# Altium project CARRIER BOARD.PrjPcb
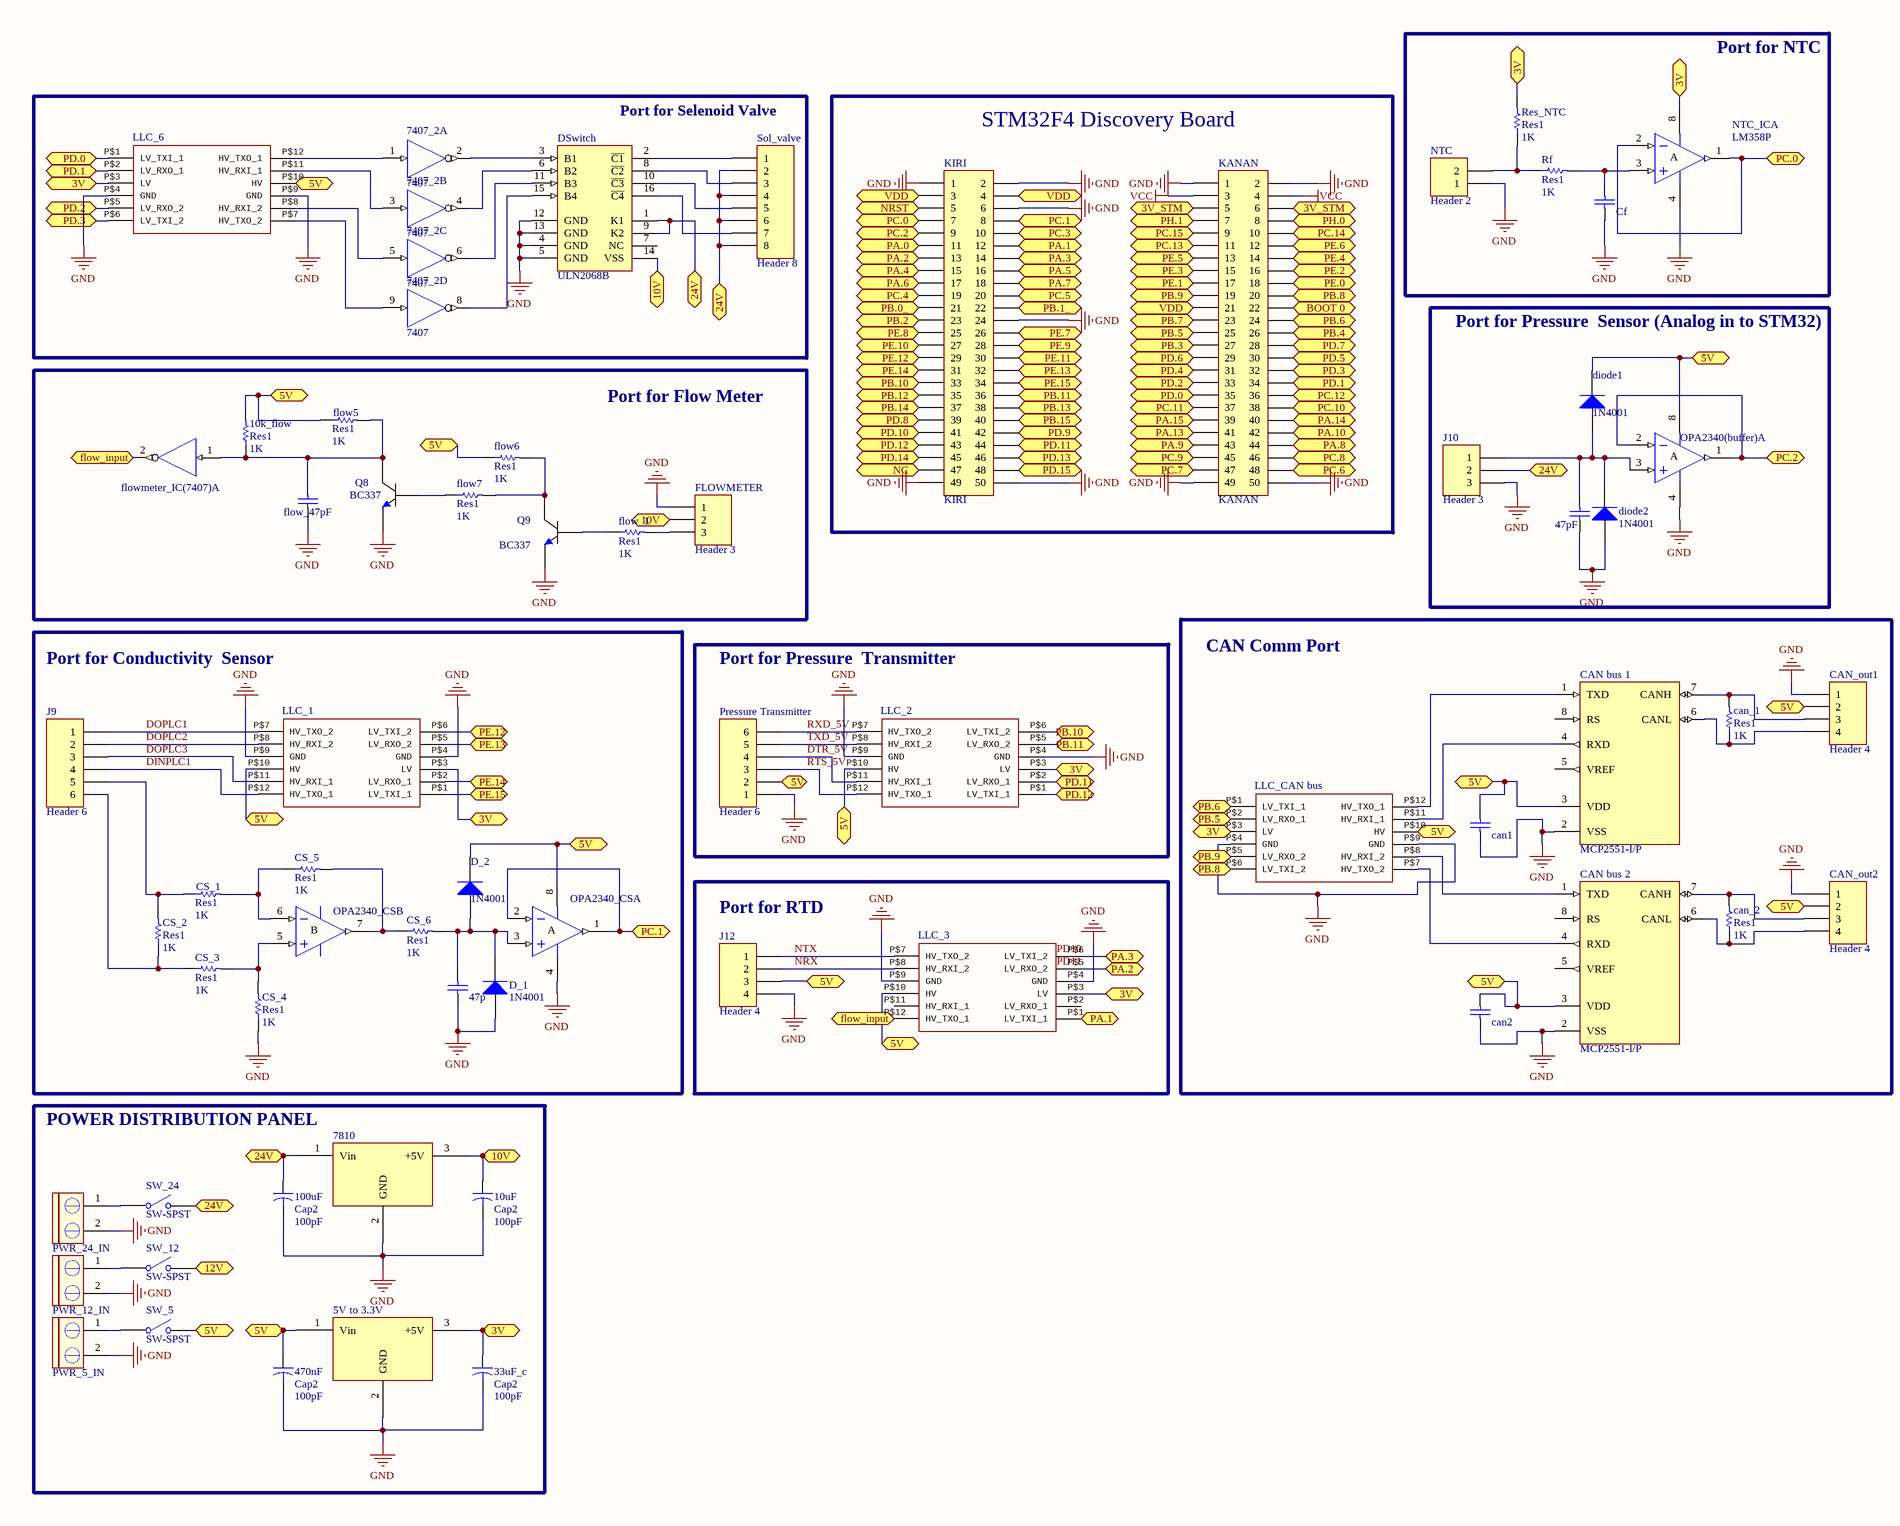
[diagram p0: Page2_.SchDoc, left]
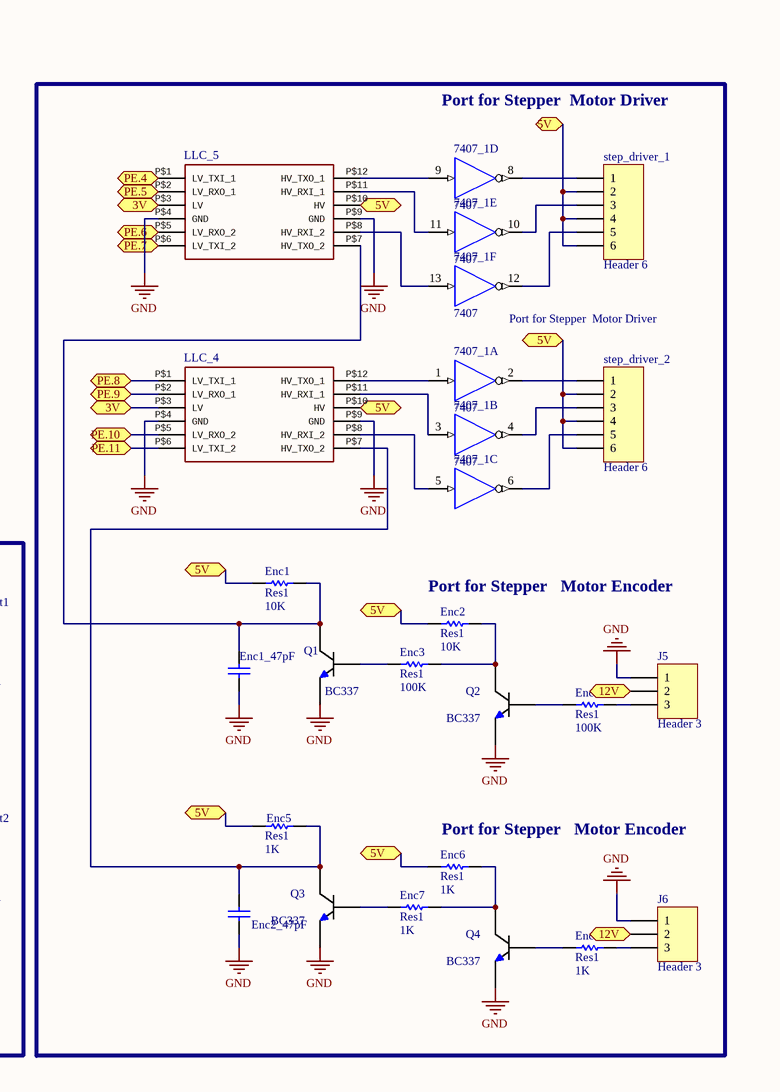
[diagram p1: Page2_.SchDoc, right]
3 sheets, 98 parts. Net scope: hierarchical (ports join the sheet entries above them; power ports are global).
Board file: carrier board mixing.PcbDoc
Sheets:
  Page2_.SchDoc
  Page3_POWER.SchDoc
    conductivity sensor = conductivity.SchDoc

## Sheet Page2_.SchDoc
size A2

### Parts
(Parts that share a designator on the sheet are numbered #1, #2 ... from top to bottom, then left to right.)
5V_to_3.3V  7805  [My_TO-220]  (value not drawn)
10k_flow  Res1  value 1K  [AXIAL-0.3]
10uF  Cap2  value 100pF  [CAPR5-4X5]
33uF_c  Cap2  value 100pF  [CAPR5-4X5]
47p#1  Cap  [My_cap100n]  (value not drawn)
47pF  Cap  [My_cap100n]  (value not drawn)
100uF  Cap2  value 100pF  [CAPR5-4X5]
470nF  Cap2  value 100pF  [CAPR5-4X5]
7407_1  7407  [646-06]  (parts A,B,C,D,E,F of 6)
7407_2  7407  [646-06]  (parts A,B,C,D of 6)
7810  7805  [My_TO-220]  (value not drawn)
can1  Cap  [My_cap100n]  (value not drawn)
can2  Cap  [My_cap100n]  (value not drawn)
can_1  Res1  value 1K  [AXIAL-0.3]
can_2  Res1  value 1K  [AXIAL-0.3]
CAN_bus_1  MCP2551-I/P  [PDIP300-P8]
CAN_bus_2  MCP2551-I/P  [PDIP300-P8]
CAN_out1  Header 4  [HDR1X4]
CAN_out2  Header 4  [HDR1X4]
Cf  Cap  [My_cap100n]  (value not drawn)
CS_1#1  Res1  value 1K  [AXIAL-0.3]
CS_2#1  Res1  value 1K  [AXIAL-0.3]
CS_3#1  Res1  value 1K  [AXIAL-0.3]
CS_4#1  Res1  value 1K  [AXIAL-0.3]
CS_5#1  Res1  value 1K  [AXIAL-0.3]
CS_6#1  Res1  value 1K  [AXIAL-0.3]
D_1#1  1N4001  [DO-41]
D_2#1  1N4001  [DO-41]
diode1  1N4001  [DO-41]
diode2  1N4001  [DO-41]
DSwitch  ULN2068B  [648C-02]
Enc1  Res1  value 10K  [AXIAL-0.3]
Enc1_47pF  Cap  [My_cap100n]  (value not drawn)
Enc2  Res1  value 10K  [AXIAL-0.3]
Enc2_47pF  Cap  [My_cap100n]  (value not drawn)
Enc3  Res1  value 100K  [AXIAL-0.3]
Enc4  Res1  value 100K  [AXIAL-0.3]
Enc5  Res1  value 1K  [AXIAL-0.3]
Enc6  Res1  value 1K  [AXIAL-0.3]
Enc7  Res1  value 1K  [AXIAL-0.3]
Enc8  Res1  value 1K  [AXIAL-0.3]
flow5  Res1  value 1K  [AXIAL-0.3]
flow6  Res1  value 1K  [AXIAL-0.3]
flow7  Res1  value 1K  [AXIAL-0.3]
flow_1  Res1  value 1K  [AXIAL-0.3]
flow_47pF  Cap  [My_cap100n]  (value not drawn)
FLOWMETER  Header 3  [HDR1X3]
flowmeter_IC(7407)  SN74LS14N  [646-06]  (value not drawn)  (part A of 6)
J5  Header 3  [HDR1X3]
J6  Header 3  [HDR1X3]
J9#1  Header 6  [HDR1X6]
J10  Header 3  [HDR1X3]
J12  Header 4  [HDR1X4]
KANAN#1  KANAN  [HDR2X25]
KIRI#1  KIRI  [HDR2X25]
LLC_1#1  Logic Level Converter (3.3v - 5v) / https://www.sparkfun.com/products/8745  [LOGIC_LEVEL_CONVERTER]  (value not drawn)
LLC_2  Logic Level Converter (3.3v - 5v) / https://www.sparkfun.com/products/8745  [LOGIC_LEVEL_CONVERTER]  (value not drawn)
LLC_3  Logic Level Converter (3.3v - 5v) / https://www.sparkfun.com/products/8745  [LOGIC_LEVEL_CONVERTER]  (value not drawn)
LLC_4  Logic Level Converter (3.3v - 5v) / https://www.sparkfun.com/products/8745  [LOGIC_LEVEL_CONVERTER]  (value not drawn)
LLC_5  Logic Level Converter (3.3v - 5v) / https://www.sparkfun.com/products/8745  [LOGIC_LEVEL_CONVERTER]  (value not drawn)
LLC_6  Logic Level Converter (3.3v - 5v) / https://www.sparkfun.com/products/8745  [LOGIC_LEVEL_CONVERTER]  (value not drawn)
LLC_CAN_bus  Logic Level Converter (3.3v - 5v) / https://www.sparkfun.com/products/8745  [LOGIC_LEVEL_CONVERTER]  (value not drawn)
NTC  Header 2  [HDR1X2]
NTC_IC  LM358P  [P008]  (part A of 2)
OPA2340(buffer)  LM358P  [P008]  (value not drawn)  (part A of 2)
OPA2340_CS#1  LM358P  [P008]  (value not drawn)  (parts A,B of 2)
Pressure_Transmitter  Header 6  [HDR1X6]
PWR_5_IN  CON2 pin blue  [My_CN2]  (value not drawn)
PWR_12_IN  CON2 pin blue  [My_CN2]  (value not drawn)
PWR_24_IN  CON2 pin blue  [My_CN2]  (value not drawn)
Q1  BC337  [TO-92]
Q2  BC337  [TO-92]
Q3  BC337  [TO-92]
Q4  BC337  [TO-92]
Q8  BC337  [TO-92]
Q9  BC337  [TO-92]
Res_NTC  Res1  value 1K  [AXIAL-0.3]
Rf  Res1  value 1K  [AXIAL-0.3]
Sol_valve  Header 8  [HDR1X8]
step_driver_1  Header 6  [HDR1X6]
step_driver_2  Header 6  [HDR1X6]
SW_5  SW-SPST  [SPST-2]
SW_12  SW-SPST  [SPST-2]
SW_24  SW-SPST  [SPST-2]

### Blocks framed on the sheet
Port for NTC: Cf NTC NTC_IC Res_NTC Rf
Port for Selenoid Valve: 7407_2 DSwitch LLC_6 Sol_valve
STM32F4 Discovery Board: KANAN#1 KIRI#1
Port for Pressure  Sensor (Analog in to STM32): 47pF diode1 diode2 J10 OPA2340(buffer)
Port for Flow Meter: 10k_flow flow5-flow7 flow_1 flow_47pF FLOWMETER flowmeter_IC(7407) Q8 Q9
Port for Conductivity  Sensor: 47p#1 CS_1#1 CS_2#1 CS_3#1 CS_4#1 CS_5#1 CS_6#1 D_1#1 D_2#1 J9#1 LLC_1#1 OPA2340_CS#1
CAN Comm Port: can1 can2 can_1 can_2 CAN_bus_1 CAN_bus_2 CAN_out1 CAN_out2 LLC_CAN_bus
Port for Pressure  Transmitter: LLC_2 Pressure_Transmitter
Port for RTD: J12 LLC_3
POWER DISTRIBUTION PANEL: 5V_to_3.3V 10uF 33uF_c 100uF 470nF 7810 PWR_5_IN PWR_12_IN PWR_24_IN SW_5 SW_12 SW_24

### Ports
3V, 3V_STM, 5V, 10V, 12V, 24V, BOOT 0, flow_input, NC, NRST, PA.0, PA.1, PA.2, PA.3, PA.4, PA.5, PA.6, PA.7, PA.8, PA.9, PA.10, PA.13, PA.14, PA.15, PB.0_, PB.1_, PB.2, PB.3, PB.4, PB.5, PB.6, PB.7, PB.8, PB.9, PB.10, PB.11, PB.12, PB.13, PB.14, PB.15, PC.0, PC.1, PC.2, PC.3, PC.4, PC.5, PC.6, PC.7, PC.8, PC.9, PC.10, PC.11, PC.12, PC.13, PC.14, PC.15, PD.0, PD.1, PD.2, PD.3, PD.4, PD.5, PD.6, PD.7, PD.8, PD.9, PD.10, PD.11, PD.12, PD.13, PD.14, PD.15, PE.0, PE.1, PE.2, PE.3, PE.4, PE.5, PE.6, PE.7, PE.8, PE.9, PE.10, PE.11, PE.12, PE.13, PE.14, PE.15, PH.0, PH.1, VDD

### Nets
GND: 5V_to_3.3V.2(GND) 10uF.2 33uF_c.2 47p#1.1 47pF.1 100uF.2 470nF.2 7407_1.7(GND) 7407_2.7(GND) 7810.2(GND) can1.1 can2.1 CAN_bus_1.2(VSS) CAN_bus_2.2(VSS) CAN_out1.1 CAN_out2.1 Cf.1 CS_4#1.1 D_1#1.1(A) diode2.1(A) DSwitch.4(GND) DSwitch.5(GND) DSwitch.12(GND) DSwitch.13(GND) Enc1_47pF.1 Enc2_47pF.1 flow_47pF.1 FLOWMETER.1 flowmeter_IC(7407).7(GND) J5.1 J6.1 J10.3 J12.4 KANAN#1.1 KANAN#1.2 KANAN#1.49 KANAN#1.50 KIRI#1.1 KIRI#1.2 KIRI#1.6 KIRI#1.24 KIRI#1.49 KIRI#1.50 LLC_1#1.P$4(GND) LLC_1#1.P$9(GND) LLC_2.P$4(GND) LLC_2.P$9(GND) LLC_3.P$4(GND) LLC_3.P$9(GND) LLC_4.P$4(GND) LLC_4.P$9(GND) LLC_5.P$4(GND) LLC_5.P$9(GND) LLC_6.P$4(GND) LLC_6.P$9(GND) LLC_CAN_bus.P$4(GND) LLC_CAN_bus.P$9(GND) NTC.1 NTC_IC.4(V-) OPA2340(buffer).4(V-) OPA2340_CS#1.4(V-) Pressure_Transmitter.1 PWR_5_IN.2 PWR_12_IN.2 PWR_24_IN.2 Q1.3(E) Q2.3(E) Q3.3(E) Q4.3(E) Q8.3(E) Q9.3(E)
VCC: KANAN#1.3 KANAN#1.4
VDD: 7407_1.14(VDD) 7407_2.14(VDD) flowmeter_IC(7407).14(VDD)
DINPLC1: J9#1.4 LLC_1#1.P$12(HV_TXO_1)
DOPLC1: J9#1.1 LLC_1#1.P$7(HV_TXO_2)
DOPLC2: J9#1.2 LLC_1#1.P$8(HV_RXI_2)
DOPLC3: J9#1.3 LLC_1#1.P$11(HV_RXI_1)
DTR_5V: LLC_2.P$11(HV_RXI_1) Pressure_Transmitter.4
NRX: J12.2 LLC_3.P$8(HV_RXI_2)
NTX: J12.1 LLC_3.P$7(HV_TXO_2)
RTS_5V: LLC_2.P$12(HV_TXO_1) Pressure_Transmitter.3
RXD_5V: LLC_2.P$7(HV_TXO_2) Pressure_Transmitter.6
TXD_5V: LLC_2.P$8(HV_RXI_2) Pressure_Transmitter.5
Net5V_to_3.3V_1: 5V_to_3.3V.1(Vin) 10k_flow.2 470nF.1 can1.2 can2.2 CAN_bus_1.3(VDD) CAN_bus_2.3(VDD) CAN_out1.2 CAN_out2.2 D_2#1.2(K) diode1.2(K) Enc1.1 Enc2.1 Enc5.1 Enc6.1 flow5.1 flow6.1 J12.3 LLC_1#1.P$10(HV) LLC_2.P$10(HV) LLC_3.P$10(HV) LLC_4.P$10(HV) LLC_5.P$10(HV) LLC_6.P$10(HV) LLC_CAN_bus.P$10(HV) OPA2340(buffer).8(V+) OPA2340_CS#1.8(V+) Pressure_Transmitter.2 step_driver_1.2 step_driver_1.4 step_driver_1.6 step_driver_2.2 step_driver_2.4 step_driver_2.6 SW_5.2(NO) ; port 5V
Net5V_to_3.3V_3: 5V_to_3.3V.3(+5V) 33uF_c.1 LLC_1#1.P$3(LV) LLC_2.P$3(LV) LLC_3.P$3(LV) LLC_4.P$3(LV) LLC_5.P$3(LV) LLC_6.P$3(LV) LLC_CAN_bus.P$3(LV) NTC_IC.8(V+) Res_NTC.2 ; port 3V
Net10k_flow_1: 10k_flow.1 flow5.2 flow_47pF.2 flowmeter_IC(7407).1(IN) Q8.1(C)
Net10uF_1: 10uF.1 7810.3(+5V) DSwitch.14(VSS) FLOWMETER.2 ; port 10V
Net47p#1_2: 47p#1.2 CS_6#1.2 D_1#1.2(K) D_2#1.1(A) OPA2340_CS#1.3(IN+)
Net47pF_2: 47pF.2 diode1.1(A) diode2.2(K) J10.1 OPA2340(buffer).3(IN+)
Net100uF_1: 100uF.1 7810.1(Vin) DSwitch.1(K1) DSwitch.9(K2) J10.2 Sol_valve.2 Sol_valve.4 Sol_valve.6 Sol_valve.8 SW_24.2(NO) ; port 24V
Net7407_1_1: 7407_1.1(IN) LLC_4.P$12(HV_TXO_1)
Net7407_1_2: 7407_1.2(~{OUT}) step_driver_2.1
Net7407_1_3: 7407_1.3(IN) LLC_4.P$11(HV_RXI_1)
Net7407_1_4: 7407_1.4(~{OUT}) step_driver_2.3
Net7407_1_5: 7407_1.5(IN) LLC_4.P$8(HV_RXI_2)
Net7407_1_6: 7407_1.6(~{OUT}) step_driver_2.5
Net7407_1_8: 7407_1.8(~{OUT}) step_driver_1.1
Net7407_1_9: 7407_1.9(IN) LLC_5.P$12(HV_TXO_1)
Net7407_1_10: 7407_1.10(~{OUT}) step_driver_1.3
Net7407_1_11: 7407_1.11(IN) LLC_5.P$11(HV_RXI_1)
Net7407_1_12: 7407_1.12(~{OUT}) step_driver_1.5
Net7407_1_13: 7407_1.13(IN) LLC_5.P$8(HV_RXI_2)
Net7407_2_1: 7407_2.1(IN) LLC_6.P$12(HV_TXO_1)
Net7407_2_2: 7407_2.2(~{OUT}) DSwitch.3(B1)
Net7407_2_3: 7407_2.3(IN) LLC_6.P$11(HV_RXI_1)
Net7407_2_4: 7407_2.4(~{OUT}) DSwitch.6(B2)
Net7407_2_5: 7407_2.5(IN) LLC_6.P$8(HV_RXI_2)
Net7407_2_6: 7407_2.6(~{OUT}) DSwitch.11(B3)
Net7407_2_8: 7407_2.8(~{OUT}) DSwitch.15(B4)
Net7407_2_9: 7407_2.9(IN) LLC_6.P$7(HV_TXO_2)
Netcan_1_1: can_1.1 CAN_bus_1.6(CANL) CAN_out1.4
Netcan_1_2: can_1.2 CAN_bus_1.7(CANH) CAN_out1.3
Netcan_2_1: can_2.1 CAN_bus_2.6(CANL) CAN_out2.4
Netcan_2_2: can_2.2 CAN_bus_2.7(CANH) CAN_out2.3
NetCAN_bus_1_1: CAN_bus_1.1(TXD) LLC_CAN_bus.P$12(HV_TXO_1)
NetCAN_bus_1_4: CAN_bus_1.4(RXD) LLC_CAN_bus.P$11(HV_RXI_1)
NetCAN_bus_2_1: CAN_bus_2.1(TXD) LLC_CAN_bus.P$8(HV_RXI_2)
NetCAN_bus_2_4: CAN_bus_2.4(RXD) LLC_CAN_bus.P$7(HV_TXO_2)
NetCf_2: Cf.2 NTC_IC.3(IN+) Rf.2
NetCS_1#1_1: CS_1#1.1 CS_2#1.2 J9#1.5
NetCS_1#1_2: CS_1#1.2 CS_5#1.1 OPA2340_CS#1.6(IN-)
NetCS_2#1_1: CS_2#1.1 CS_3#1.1 J9#1.6
NetCS_3#1_2: CS_3#1.2 CS_4#1.2 OPA2340_CS#1.5(IN+)
NetCS_5#1_2: CS_5#1.2 CS_6#1.1 OPA2340_CS#1.7(OUT)
NetDSwitch_2: DSwitch.2(~{C1}) Sol_valve.1
NetDSwitch_8: DSwitch.8(~{C2}) Sol_valve.3
NetDSwitch_10: DSwitch.10(~{C3}) Sol_valve.5
NetDSwitch_16: DSwitch.16(~{C4}) Sol_valve.7
NetEnc1_2: Enc1.2 Enc1_47pF.2 LLC_5.P$7(HV_TXO_2) Q1.1(C)
NetEnc2_2: Enc2.2 Enc3.2 Q2.1(C)
NetEnc2_47pF_2: Enc2_47pF.2 Enc5.2 LLC_4.P$7(HV_TXO_2) Q3.1(C)
NetEnc3_1: Enc3.1 Q1.2(B)
NetEnc4_1: Enc4.1 Q2.2(B)
NetEnc4_2: Enc4.2 J5.3
NetEnc6_2: Enc6.2 Enc7.2 Q4.1(C)
NetEnc7_1: Enc7.1 Q3.2(B)
NetEnc8_1: Enc8.1 Q4.2(B)
NetEnc8_2: Enc8.2 J6.3
Netflow6_2: flow6.2 flow7.2 Q9.1(C)
Netflow7_1: flow7.1 Q8.2(B)
Netflow_1_1: flow_1.1 Q9.2(B)
Netflow_1_2: flow_1.2 FLOWMETER.3
Netflowmeter_IC(7407)_2: flowmeter_IC(7407).2(~{OUT}) LLC_3.P$12(HV_TXO_1) ; port flow_input
NetJ5_2: J5.2 J6.2 SW_12.2(NO) ; port 12V
NetKANAN#1_5: KANAN#1.5 KANAN#1.6 ; port 3V_STM
NetKANAN#1_7: KANAN#1.7 ; port PH.1
NetKANAN#1_8: KANAN#1.8 ; port PH.0
NetKANAN#1_9: KANAN#1.9 ; port PC.15
NetKANAN#1_10: KANAN#1.10 ; port PC.14
NetKANAN#1_11: KANAN#1.11 ; port PC.13
NetKANAN#1_12: KANAN#1.12 LLC_5.P$5(LV_RXO_2) ; port PE.6
NetKANAN#1_13: KANAN#1.13 LLC_5.P$2(LV_RXO_1) ; port PE.5
NetKANAN#1_14: KANAN#1.14 LLC_5.P$1(LV_TXI_1) ; port PE.4
NetKANAN#1_15: KANAN#1.15 ; port PE.3
NetKANAN#1_16: KANAN#1.16 ; port PE.2
NetKANAN#1_17: KANAN#1.17 ; port PE.1
NetKANAN#1_18: KANAN#1.18 ; port PE.0
NetKANAN#1_19: KANAN#1.19 LLC_CAN_bus.P$5(LV_RXO_2) ; port PB.9
NetKANAN#1_20: KANAN#1.20 LLC_CAN_bus.P$6(LV_TXI_2) ; port PB.8
NetKANAN#1_21: KANAN#1.21 KIRI#1.3 KIRI#1.4 ; port VDD
NetKANAN#1_22: KANAN#1.22 ; port BOOT 0
NetKANAN#1_23: KANAN#1.23 ; port PB.7
NetKANAN#1_24: KANAN#1.24 LLC_CAN_bus.P$1(LV_TXI_1) ; port PB.6
NetKANAN#1_25: KANAN#1.25 LLC_CAN_bus.P$2(LV_RXO_1) ; port PB.5
NetKANAN#1_26: KANAN#1.26 ; port PB.4
NetKANAN#1_27: KANAN#1.27 ; port PB.3
NetKANAN#1_28: KANAN#1.28 ; port PD.7
NetKANAN#1_29: KANAN#1.29 ; port PD.6
NetKANAN#1_30: KANAN#1.30 ; port PD.5
NetKANAN#1_31: KANAN#1.31 ; port PD.4
NetKANAN#1_32: KANAN#1.32 LLC_6.P$6(LV_TXI_2) ; port PD.3
NetKANAN#1_33: KANAN#1.33 LLC_6.P$5(LV_RXO_2) ; port PD.2
NetKANAN#1_34: KANAN#1.34 LLC_6.P$2(LV_RXO_1) ; port PD.1
NetKANAN#1_35: KANAN#1.35 LLC_6.P$1(LV_TXI_1) ; port PD.0
NetKANAN#1_36: KANAN#1.36 ; port PC.12
NetKANAN#1_37: KANAN#1.37 ; port PC.11
NetKANAN#1_38: KANAN#1.38 ; port PC.10
NetKANAN#1_39: KANAN#1.39 ; port PA.15
NetKANAN#1_40: KANAN#1.40 ; port PA.14
NetKANAN#1_41: KANAN#1.41 ; port PA.13
NetKANAN#1_42: KANAN#1.42 ; port PA.10
NetKANAN#1_43: KANAN#1.43 ; port PA.9
NetKANAN#1_44: KANAN#1.44 ; port PA.8
NetKANAN#1_45: KANAN#1.45 ; port PC.9
NetKANAN#1_46: KANAN#1.46 ; port PC.8
NetKANAN#1_47: KANAN#1.47 ; port PC.7
NetKANAN#1_48: KANAN#1.48 ; port PC.6
NetKIRI#1_5: KIRI#1.5 ; port NRST
NetKIRI#1_7: KIRI#1.7 NTC_IC.1(OUT) NTC_IC.2(IN-) ; port PC.0
NetKIRI#1_8: KIRI#1.8 OPA2340_CS#1.1(OUT) OPA2340_CS#1.2(IN-) ; port PC.1
NetKIRI#1_9: KIRI#1.9 OPA2340(buffer).1(OUT) OPA2340(buffer).2(IN-) ; port PC.2
NetKIRI#1_10: KIRI#1.10 ; port PC.3
NetKIRI#1_11: KIRI#1.11 ; port PA.0
NetKIRI#1_12: KIRI#1.12 LLC_3.P$1(LV_TXI_1) ; port PA.1
NetKIRI#1_13: KIRI#1.13 LLC_3.P$5(LV_RXO_2) ; port PA.2
NetKIRI#1_14: KIRI#1.14 LLC_3.P$6(LV_TXI_2) ; port PA.3
NetKIRI#1_15: KIRI#1.15 ; port PA.4
NetKIRI#1_16: KIRI#1.16 ; port PA.5
NetKIRI#1_17: KIRI#1.17 ; port PA.6
NetKIRI#1_18: KIRI#1.18 ; port PA.7
NetKIRI#1_19: KIRI#1.19 ; port PC.4
NetKIRI#1_20: KIRI#1.20 ; port PC.5
NetKIRI#1_21: KIRI#1.21 ; port PB.0_
NetKIRI#1_22: KIRI#1.22 ; port PB.1_
NetKIRI#1_23: KIRI#1.23 ; port PB.2
NetKIRI#1_25: KIRI#1.25 LLC_4.P$1(LV_TXI_1) ; port PE.8
NetKIRI#1_26: KIRI#1.26 LLC_5.P$6(LV_TXI_2) ; port PE.7
NetKIRI#1_27: KIRI#1.27 LLC_4.P$5(LV_RXO_2) ; port PE.10
NetKIRI#1_28: KIRI#1.28 LLC_4.P$2(LV_RXO_1) ; port PE.9
NetKIRI#1_29: KIRI#1.29 LLC_1#1.P$6(LV_TXI_2) ; port PE.12
NetKIRI#1_30: KIRI#1.30 LLC_4.P$6(LV_TXI_2) ; port PE.11
NetKIRI#1_31: KIRI#1.31 LLC_1#1.P$2(LV_RXO_1) ; port PE.14
NetKIRI#1_32: KIRI#1.32 LLC_1#1.P$5(LV_RXO_2) ; port PE.13
NetKIRI#1_33: KIRI#1.33 LLC_2.P$6(LV_TXI_2) ; port PB.10
NetKIRI#1_34: KIRI#1.34 LLC_1#1.P$1(LV_TXI_1) ; port PE.15
NetKIRI#1_35: KIRI#1.35 ; port PB.12
NetKIRI#1_36: KIRI#1.36 LLC_2.P$5(LV_RXO_2) ; port PB.11
NetKIRI#1_37: KIRI#1.37 ; port PB.14
NetKIRI#1_38: KIRI#1.38 ; port PB.13
NetKIRI#1_39: KIRI#1.39 ; port PD.8
NetKIRI#1_40: KIRI#1.40 ; port PB.15
NetKIRI#1_41: KIRI#1.41 ; port PD.10
NetKIRI#1_42: KIRI#1.42 ; port PD.9
NetKIRI#1_43: KIRI#1.43 LLC_2.P$1(LV_TXI_1) ; port PD.12
NetKIRI#1_44: KIRI#1.44 LLC_2.P$2(LV_RXO_1) ; port PD.11
NetKIRI#1_45: KIRI#1.45 ; port PD.14
NetKIRI#1_46: KIRI#1.46 ; port PD.13
NetKIRI#1_47: KIRI#1.47 ; port NC
NetKIRI#1_48: KIRI#1.48 ; port PD.15
NetNTC_2: NTC.2 Res_NTC.1 Rf.1
NetPWR_5_IN_1: PWR_5_IN.1 SW_5.1(COMMON)
NetPWR_12_IN_1: PWR_12_IN.1 SW_12.1(COMMON)
NetPWR_24_IN_1: PWR_24_IN.1 SW_24.1(COMMON)

Not connected (* = marked no-connect by the designer): CAN_bus_1 5(VREF) 8(RS); CAN_bus_2 5(VREF) 8(RS); DSwitch 7(NC); LLC_3 P$2(LV_RXO_1) P$11(HV_RXI_1)

### Notes on the sheet
- Port for Stepper  Motor Driver
- (near 7407_1) Port for Stepper  Motor Driver
- (near Enc2) Port for Stepper   Motor Encoder
- (near Enc6) Port for Stepper   Motor Encoder
- Labels drawn without touching a wire or pin: PD10, PD11
- (in symbol LM358P, part A) A
- (in symbol LM358P, part B) B

### Library data of the parts
5V_to_3.3V 7810 = 7805: Regulator
10k_flow can_1 can_2 CS_1#1 CS_2#1 CS_3#1 CS_4#1 CS_5#1 CS_6#1 Enc1-Enc8 flow5-flow7 flow_1 Res_NTC Rf = Res1: Resistor; Published: 8-Jun-2000; LatestRevisionDate: 17-Jul-2002; LatestRevisionNote: Re-released for DXP Platform.; PackageReference: AXIAL-0.3; Publisher: Altium Limited; PackageDescription: Axial Device, Thru-Hole; 2 Leads; 0.3 in Pin Spacing
10uF 33uF_c 100uF 470nF = Cap2: Capacitor; Published: 23-Sep-2002; PackageReference: CAPR5-4X5; Publisher: Altium Limited; PackageDescription: Capacitor; 2 Leads
47p#1 47pF can1 can2 Cf Enc1_47pF Enc2_47pF flow_47pF = Cap ceramic: CAP-100Nf; Value: 100nF
7407_1 7407_2 flowmeter_IC(7407) = SN74LS14N: Hex Schmitt-Trigger Inverter; Published: 15-Apr-2002; DatasheetVersion: 18-Oct-1996; PackageVersion: 1995; PackageReference: 646-06; Publisher: Altium Limited; PackageDescription: DIP; 14 Leads; Row Spacing 7.62 mm; Pitch 2.54 mm; ComponentLink1Description: Manufacturer Link; ComponentLink1URL: http://www.onsemi.com/; ComponentLink2Description: Datasheet; ComponentLink2URL: http://www.onsemi.com/pub/Collateral/SN74LS14-D.PDF
CAN_bus_1 CAN_bus_2 = MCP2551-I/P: High-Speed CAN Transceiver, 8-Pin PDIP, Industrial Temperature; Published: 29-Jan-2009; DatasheetVersion: revE, Jan-2007; PackageVersion: revBB, Aug-2009; PackageReference: PDIP300-P8; Publisher: Altium Limited; PackageDescription: 8-Lead Plastic Dual In-Line (P) - 300 mil Body [PDIP]; Supplier 1: Digi-Key; Supplier Part Number 1: MCP2551-I/P-ND; Supplier 2: Farnell; Supplier Part Number 2: 1292240; Code_JEDEC: MS-001; ComponentLink1Description: Datasheet; ComponentLink1URL: http://ww1.microchip.com/downloads/en/DeviceDoc/21667E.pdf; ComponentLink2Description: Packaging Specification; ComponentLink2URL: http://www.microchip.com/stellent/groups/techpub_sg/documents/packagingspec/en012702.pdf; ComponentLink3Description: Microchip.com Home; ComponentLink3URL: http://www.microchip.com/
CAN_out1 CAN_out2 J12 = Header 4: Header, 4-Pin; LatestRevisionDate: 17-Jul-2002; LatestRevisionNote: Re-released for DXP Platform.; Publisher: Altium Limited
D_1#1 D_2#1 diode1 diode2 = Diode 1N4001: 1 Amp General Purpose Rectifier; Published: 8-Jun-2000; LatestRevisionDate: 17-Jul-2002; LatestRevisionNote: Re-released for DXP Platform.; DatasheetVersion: 1998; PackageVersion: Aug-1999; PackageReference: DO-41; Publisher: Altium Limited; PackageDescription: Diode, Axial; Body 5.2 x 2.7 mm (LxDia. max), Lead Dia. 0.86 mm (max); Code_JEDEC: DO-204-AL; ComponentLink1Description: Manufacturer Link; ComponentLink1URL: http://www.fairchildsemi.com/; ComponentLink2Description: Datasheet; ComponentLink2URL: http://www.fairchildsemi.com/ds/1N%2F1N4001.pdf
DSwitch = ULN2068B: Quad 1.5A Darlington Switch; Published: 17-Jul-2002; LatestRevisionDate: 06-Jun-2005; LatestRevisionNote: Stylized 3D Model Added.; DatasheetVersion: 1988; PackageReference: 648C-02; Publisher: Altium Limited; PackageDescription: DIP; 16 Leads; Row Spacing 7.62 mm; Pitch 2.54 mm
FLOWMETER J5 J6 J10 = Header 3: Header, 3-Pin; LatestRevisionDate: 17-Jul-2002; LatestRevisionNote: Re-released for DXP Platform.; Publisher: Altium Limited
J9#1 Pressure_Transmitter step_driver_1 step_driver_2 = Header 6: Header, 6-Pin; LatestRevisionDate: 17-Jul-2002; LatestRevisionNote: Re-released for DXP Platform.; Publisher: Altium Limited
KANAN#1 KIRI#1 = Header 25X2: Header, 25-Pin, Dual row; LatestRevisionDate: 17-Jul-2002; LatestRevisionNote: Re-released for DXP Platform.; Publisher: Altium Limited
LLC_1#1 LLC_2-LLC_6 LLC_CAN_bus = LOGIC_LEVEL_CONVERTER
NTC = Header 2: Header, 2-Pin; LatestRevisionDate: 17-Jul-2002; LatestRevisionNote: Re-released for DXP Platform.; Publisher: Altium Limited
NTC_IC OPA2340(buffer) OPA2340_CS#1 = LM358P: Dual Operational Amplifier; Published: 16-Jan-2001; LatestRevisionDate: 04-Mar-2005; LatestRevisionNote: Stylized 3D Model Added.; DatasheetVersion: Jul-1998; PackageVersion: Jun-1999; PackageReference: P008; Publisher: Altium Limited; PackageDescription: DIP; 8 Leads; Row Spacing 7.62 mm; Pitch 2.54 mm; Code_JEDEC: MO-001-AN; ComponentLink1Description: Manufacturer Link; ComponentLink1URL: http://www.ti.com/; ComponentLink2Description: Datasheet; ComponentLink2URL: http://www-s.ti.com/sc/ds/lm358.pdf
PWR_5_IN PWR_12_IN PWR_24_IN = CON2 pin blue: Connector blue screw
Q1-Q4 Q8 Q9 = BC337: Transistor, NPN, 300MHz, 40V, 200mA, SOT-23 pkg
Sol_valve = Header 8: Header, 8-Pin; LatestRevisionDate: 17-Jul-2002; LatestRevisionNote: Re-released for DXP Platform.; Publisher: Altium Limited
SW_5 SW_12 SW_24 = SW-SPST: Single-Pole, Single-Throw Switch; Published: 24-Mar-1999; LatestRevisionDate: 17-Jul-2002; LatestRevisionNote: Re-released for DXP Platform.; PackageReference: SPST-2; Publisher: Altium Limited; PackageDescription: Switch; 2 Leads

## Sheet Page3_POWER.SchDoc
size B
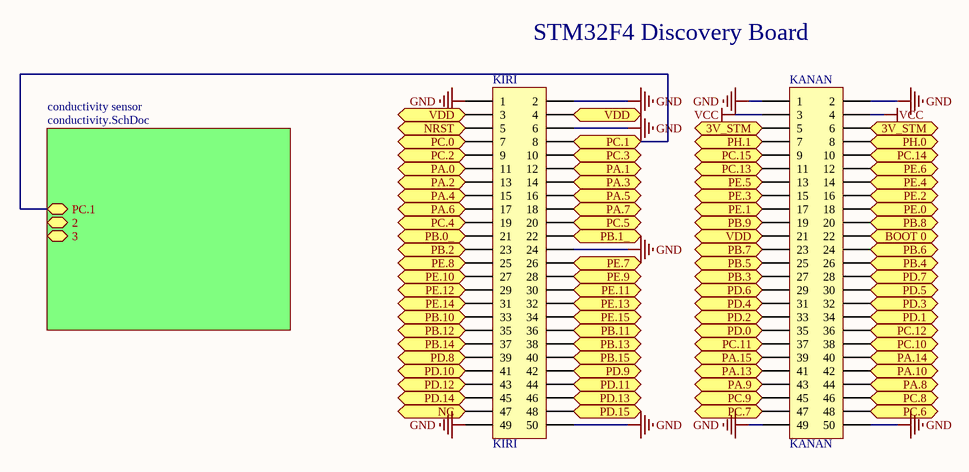
[diagram p2: Page3_POWER.SchDoc]

### Parts
(Parts that share a designator on the sheet are numbered #1, #2 ... from top to bottom, then left to right.)
KANAN#2  KANAN  [HDR2X25]
KIRI#2  KIRI  [HDR2X25]

### Sub-sheets
conductivity sensor = conductivity.SchDoc: PC.1, 2, 3

### Ports
3V_STM, BOOT 0, NC, NRST, PA.0, PA.1, PA.2, PA.3, PA.4, PA.5, PA.6, PA.7, PA.8, PA.9, PA.10, PA.13, PA.14, PA.15, PB.0_, PB.1_, PB.2, PB.3, PB.4, PB.5, PB.6, PB.7, PB.8, PB.9, PB.10, PB.11, PB.12, PB.13, PB.14, PB.15, PC.0, PC.1, PC.2, PC.3, PC.4, PC.5, PC.6, PC.7, PC.8, PC.9, PC.10, PC.11, PC.12, PC.13, PC.14, PC.15, PD.0, PD.1, PD.2, PD.3, PD.4, PD.5, PD.6, PD.7, PD.8, PD.9, PD.10, PD.11, PD.12, PD.13, PD.14, PD.15, PE.0, PE.1, PE.2, PE.3, PE.4, PE.5, PE.6, PE.7, PE.8, PE.9, PE.10, PE.11, PE.12, PE.13, PE.14, PE.15, PH.0, PH.1, VDD

### Nets
GND: KANAN#2.1 KANAN#2.2 KANAN#2.49 KANAN#2.50 KIRI#2.1 KIRI#2.2 KIRI#2.6 KIRI#2.24 KIRI#2.49 KIRI#2.50
VCC: KANAN#2.3 KANAN#2.4
NetKANAN#2_5: KANAN#2.5 KANAN#2.6 ; port 3V_STM
NetKANAN#2_7: KANAN#2.7 ; port PH.1
NetKANAN#2_8: KANAN#2.8 ; port PH.0
NetKANAN#2_9: KANAN#2.9 ; port PC.15
NetKANAN#2_10: KANAN#2.10 ; port PC.14
NetKANAN#2_11: KANAN#2.11 ; port PC.13
NetKANAN#2_12: KANAN#2.12 ; port PE.6
NetKANAN#2_13: KANAN#2.13 ; port PE.5
NetKANAN#2_14: KANAN#2.14 ; port PE.4
NetKANAN#2_15: KANAN#2.15 ; port PE.3
NetKANAN#2_16: KANAN#2.16 ; port PE.2
NetKANAN#2_17: KANAN#2.17 ; port PE.1
NetKANAN#2_18: KANAN#2.18 ; port PE.0
NetKANAN#2_19: KANAN#2.19 ; port PB.9
NetKANAN#2_20: KANAN#2.20 ; port PB.8
NetKANAN#2_21: KANAN#2.21 KIRI#2.3 KIRI#2.4 ; port VDD
NetKANAN#2_22: KANAN#2.22 ; port BOOT 0
NetKANAN#2_23: KANAN#2.23 ; port PB.7
NetKANAN#2_24: KANAN#2.24 ; port PB.6
NetKANAN#2_25: KANAN#2.25 ; port PB.5
NetKANAN#2_26: KANAN#2.26 ; port PB.4
NetKANAN#2_27: KANAN#2.27 ; port PB.3
NetKANAN#2_28: KANAN#2.28 ; port PD.7
NetKANAN#2_29: KANAN#2.29 ; port PD.6
NetKANAN#2_30: KANAN#2.30 ; port PD.5
NetKANAN#2_31: KANAN#2.31 ; port PD.4
NetKANAN#2_32: KANAN#2.32 ; port PD.3
NetKANAN#2_33: KANAN#2.33 ; port PD.2
NetKANAN#2_34: KANAN#2.34 ; port PD.1
NetKANAN#2_35: KANAN#2.35 ; port PD.0
NetKANAN#2_36: KANAN#2.36 ; port PC.12
NetKANAN#2_37: KANAN#2.37 ; port PC.11
NetKANAN#2_38: KANAN#2.38 ; port PC.10
NetKANAN#2_39: KANAN#2.39 ; port PA.15
NetKANAN#2_40: KANAN#2.40 ; port PA.14
NetKANAN#2_41: KANAN#2.41 ; port PA.13
NetKANAN#2_42: KANAN#2.42 ; port PA.10
NetKANAN#2_43: KANAN#2.43 ; port PA.9
NetKANAN#2_44: KANAN#2.44 ; port PA.8
NetKANAN#2_45: KANAN#2.45 ; port PC.9
NetKANAN#2_46: KANAN#2.46 ; port PC.8
NetKANAN#2_47: KANAN#2.47 ; port PC.7
NetKANAN#2_48: KANAN#2.48 ; port PC.6
NetKIRI#2_5: KIRI#2.5 ; port NRST
NetKIRI#2_7: KIRI#2.7 ; port PC.0
NetKIRI#2_8: KIRI#2.8 ; port PC.1, sheet conductivity sensor/PC.1
NetKIRI#2_9: KIRI#2.9 ; port PC.2
NetKIRI#2_10: KIRI#2.10 ; port PC.3
NetKIRI#2_11: KIRI#2.11 ; port PA.0
NetKIRI#2_12: KIRI#2.12 ; port PA.1
NetKIRI#2_13: KIRI#2.13 ; port PA.2
NetKIRI#2_14: KIRI#2.14 ; port PA.3
NetKIRI#2_15: KIRI#2.15 ; port PA.4
NetKIRI#2_16: KIRI#2.16 ; port PA.5
NetKIRI#2_17: KIRI#2.17 ; port PA.6
NetKIRI#2_18: KIRI#2.18 ; port PA.7
NetKIRI#2_19: KIRI#2.19 ; port PC.4
NetKIRI#2_20: KIRI#2.20 ; port PC.5
NetKIRI#2_21: KIRI#2.21 ; port PB.0_
NetKIRI#2_22: KIRI#2.22 ; port PB.1_
NetKIRI#2_23: KIRI#2.23 ; port PB.2
NetKIRI#2_25: KIRI#2.25 ; port PE.8
NetKIRI#2_26: KIRI#2.26 ; port PE.7
NetKIRI#2_27: KIRI#2.27 ; port PE.10
NetKIRI#2_28: KIRI#2.28 ; port PE.9
NetKIRI#2_29: KIRI#2.29 ; port PE.12
NetKIRI#2_30: KIRI#2.30 ; port PE.11
NetKIRI#2_31: KIRI#2.31 ; port PE.14
NetKIRI#2_32: KIRI#2.32 ; port PE.13
NetKIRI#2_33: KIRI#2.33 ; port PB.10
NetKIRI#2_34: KIRI#2.34 ; port PE.15
NetKIRI#2_35: KIRI#2.35 ; port PB.12
NetKIRI#2_36: KIRI#2.36 ; port PB.11
NetKIRI#2_37: KIRI#2.37 ; port PB.14
NetKIRI#2_38: KIRI#2.38 ; port PB.13
NetKIRI#2_39: KIRI#2.39 ; port PD.8
NetKIRI#2_40: KIRI#2.40 ; port PB.15
NetKIRI#2_41: KIRI#2.41 ; port PD.10
NetKIRI#2_42: KIRI#2.42 ; port PD.9
NetKIRI#2_43: KIRI#2.43 ; port PD.12
NetKIRI#2_44: KIRI#2.44 ; port PD.11
NetKIRI#2_45: KIRI#2.45 ; port PD.14
NetKIRI#2_46: KIRI#2.46 ; port PD.13
NetKIRI#2_47: KIRI#2.47 ; port NC
NetKIRI#2_48: KIRI#2.48 ; port PD.15

### Notes on the sheet
- STM32F4 Discovery Board

### Library data of the parts
KANAN#2 KIRI#2 = Header 25X2: Header, 25-Pin, Dual row; LatestRevisionDate: 17-Jul-2002; LatestRevisionNote: Re-released for DXP Platform.; Publisher: Altium Limited

## Sheet conductivity.SchDoc
size A4
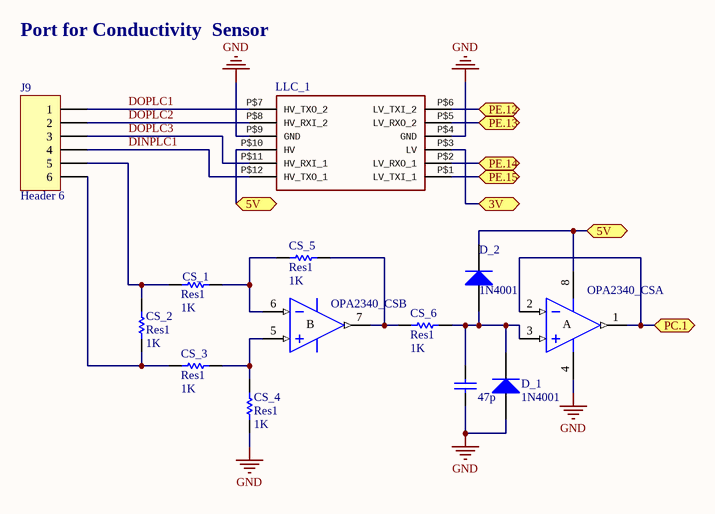
[diagram p3: conductivity.SchDoc]

### Parts
(Parts that share a designator on the sheet are numbered #1, #2 ... from top to bottom, then left to right.)
47p#2  Cap  [My_cap100n]  (value not drawn)
CS_1#2  Res1  value 1K  [AXIAL-0.3]
CS_2#2  Res1  value 1K  [AXIAL-0.3]
CS_3#2  Res1  value 1K  [AXIAL-0.3]
CS_4#2  Res1  value 1K  [AXIAL-0.3]
CS_5#2  Res1  value 1K  [AXIAL-0.3]
CS_6#2  Res1  value 1K  [AXIAL-0.3]
D_1#2  1N4001  [DO-41]
D_2#2  1N4001  [DO-41]
J9#2  Header 6  [HDR1X6]
LLC_1#2  Logic Level Converter (3.3v - 5v) / https://www.sparkfun.com/products/8745  [LOGIC_LEVEL_CONVERTER]  (value not drawn)
OPA2340_CS#2  LM358P  [P008]  (value not drawn)  (parts A,B of 2)

### Ports
3V, 5V, PC.1, PE.12, PE.13, PE.14, PE.15

### Nets
GND: 47p#2.1 CS_4#2.1 D_1#2.1(A) LLC_1#2.P$4(GND) LLC_1#2.P$9(GND) OPA2340_CS#2.4(V-)
DINPLC1: J9#2.4 LLC_1#2.P$12(HV_TXO_1)
DOPLC1: J9#2.1 LLC_1#2.P$7(HV_TXO_2)
DOPLC2: J9#2.2 LLC_1#2.P$8(HV_RXI_2)
DOPLC3: J9#2.3 LLC_1#2.P$11(HV_RXI_1)
Net47p#2_2: 47p#2.2 CS_6#2.2 D_1#2.2(K) D_2#2.1(A) OPA2340_CS#2.3(IN+)
NetCS_1#2_1: CS_1#2.1 CS_2#2.2 J9#2.5
NetCS_1#2_2: CS_1#2.2 CS_5#2.1 OPA2340_CS#2.6(IN-)
NetCS_2#2_1: CS_2#2.1 CS_3#2.1 J9#2.6
NetCS_3#2_2: CS_3#2.2 CS_4#2.2 OPA2340_CS#2.5(IN+)
NetCS_5#2_2: CS_5#2.2 CS_6#2.1 OPA2340_CS#2.7(OUT)
NetD_2#2_2: D_2#2.2(K) LLC_1#2.P$10(HV) OPA2340_CS#2.8(V+) ; port 5V
NetKIRI#2_8: OPA2340_CS#2.1(OUT) OPA2340_CS#2.2(IN-) ; port PC.1
NetLLC_1#2_P$1: LLC_1#2.P$1(LV_TXI_1) ; port PE.15
NetLLC_1#2_P$2: LLC_1#2.P$2(LV_RXO_1) ; port PE.14
NetLLC_1#2_P$3: LLC_1#2.P$3(LV) ; port 3V
NetLLC_1#2_P$5: LLC_1#2.P$5(LV_RXO_2) ; port PE.13
NetLLC_1#2_P$6: LLC_1#2.P$6(LV_TXI_2) ; port PE.12

### Notes on the sheet
- Port for Conductivity  Sensor
- (in symbol LM358P, part A) A
- (in symbol LM358P, part B) B

### Library data of the parts
47p#2 = Cap ceramic: CAP-100Nf; Value: 100nF
CS_1#2 CS_2#2 CS_3#2 CS_4#2 CS_5#2 CS_6#2 = Res1: Resistor; Published: 8-Jun-2000; LatestRevisionDate: 17-Jul-2002; LatestRevisionNote: Re-released for DXP Platform.; PackageReference: AXIAL-0.3; Publisher: Altium Limited; PackageDescription: Axial Device, Thru-Hole; 2 Leads; 0.3 in Pin Spacing
D_1#2 D_2#2 = Diode 1N4001: 1 Amp General Purpose Rectifier; Published: 8-Jun-2000; LatestRevisionDate: 17-Jul-2002; LatestRevisionNote: Re-released for DXP Platform.; DatasheetVersion: 1998; PackageVersion: Aug-1999; PackageReference: DO-41; Publisher: Altium Limited; PackageDescription: Diode, Axial; Body 5.2 x 2.7 mm (LxDia. max), Lead Dia. 0.86 mm (max); Code_JEDEC: DO-204-AL; ComponentLink1Description: Manufacturer Link; ComponentLink1URL: http://www.fairchildsemi.com/; ComponentLink2Description: Datasheet; ComponentLink2URL: http://www.fairchildsemi.com/ds/1N%2F1N4001.pdf
J9#2 = Header 6: Header, 6-Pin; LatestRevisionDate: 17-Jul-2002; LatestRevisionNote: Re-released for DXP Platform.; Publisher: Altium Limited
LLC_1#2 = LOGIC_LEVEL_CONVERTER
OPA2340_CS#2 = LM358P: Dual Operational Amplifier; Published: 16-Jan-2001; LatestRevisionDate: 04-Mar-2005; LatestRevisionNote: Stylized 3D Model Added.; DatasheetVersion: Jul-1998; PackageVersion: Jun-1999; PackageReference: P008; Publisher: Altium Limited; PackageDescription: DIP; 8 Leads; Row Spacing 7.62 mm; Pitch 2.54 mm; Code_JEDEC: MO-001-AN; ComponentLink1Description: Manufacturer Link; ComponentLink1URL: http://www.ti.com/; ComponentLink2Description: Datasheet; ComponentLink2URL: http://www-s.ti.com/sc/ds/lm358.pdf

## Nets that join several sheets
GND: Page2_ (71 pins), Page3_POWER (10 pins), conductivity (6 pins)
VCC: Page2_ (KANAN#1.3 KANAN#1.4), Page3_POWER (KANAN#2.3 KANAN#2.4)
NetKIRI#2_8: Page3_POWER (KIRI#2.8), conductivity (OPA2340_CS#2.1 OPA2340_CS#2.2)